# EAGLE design Sania_SCH (EAGLE 9.5.2)
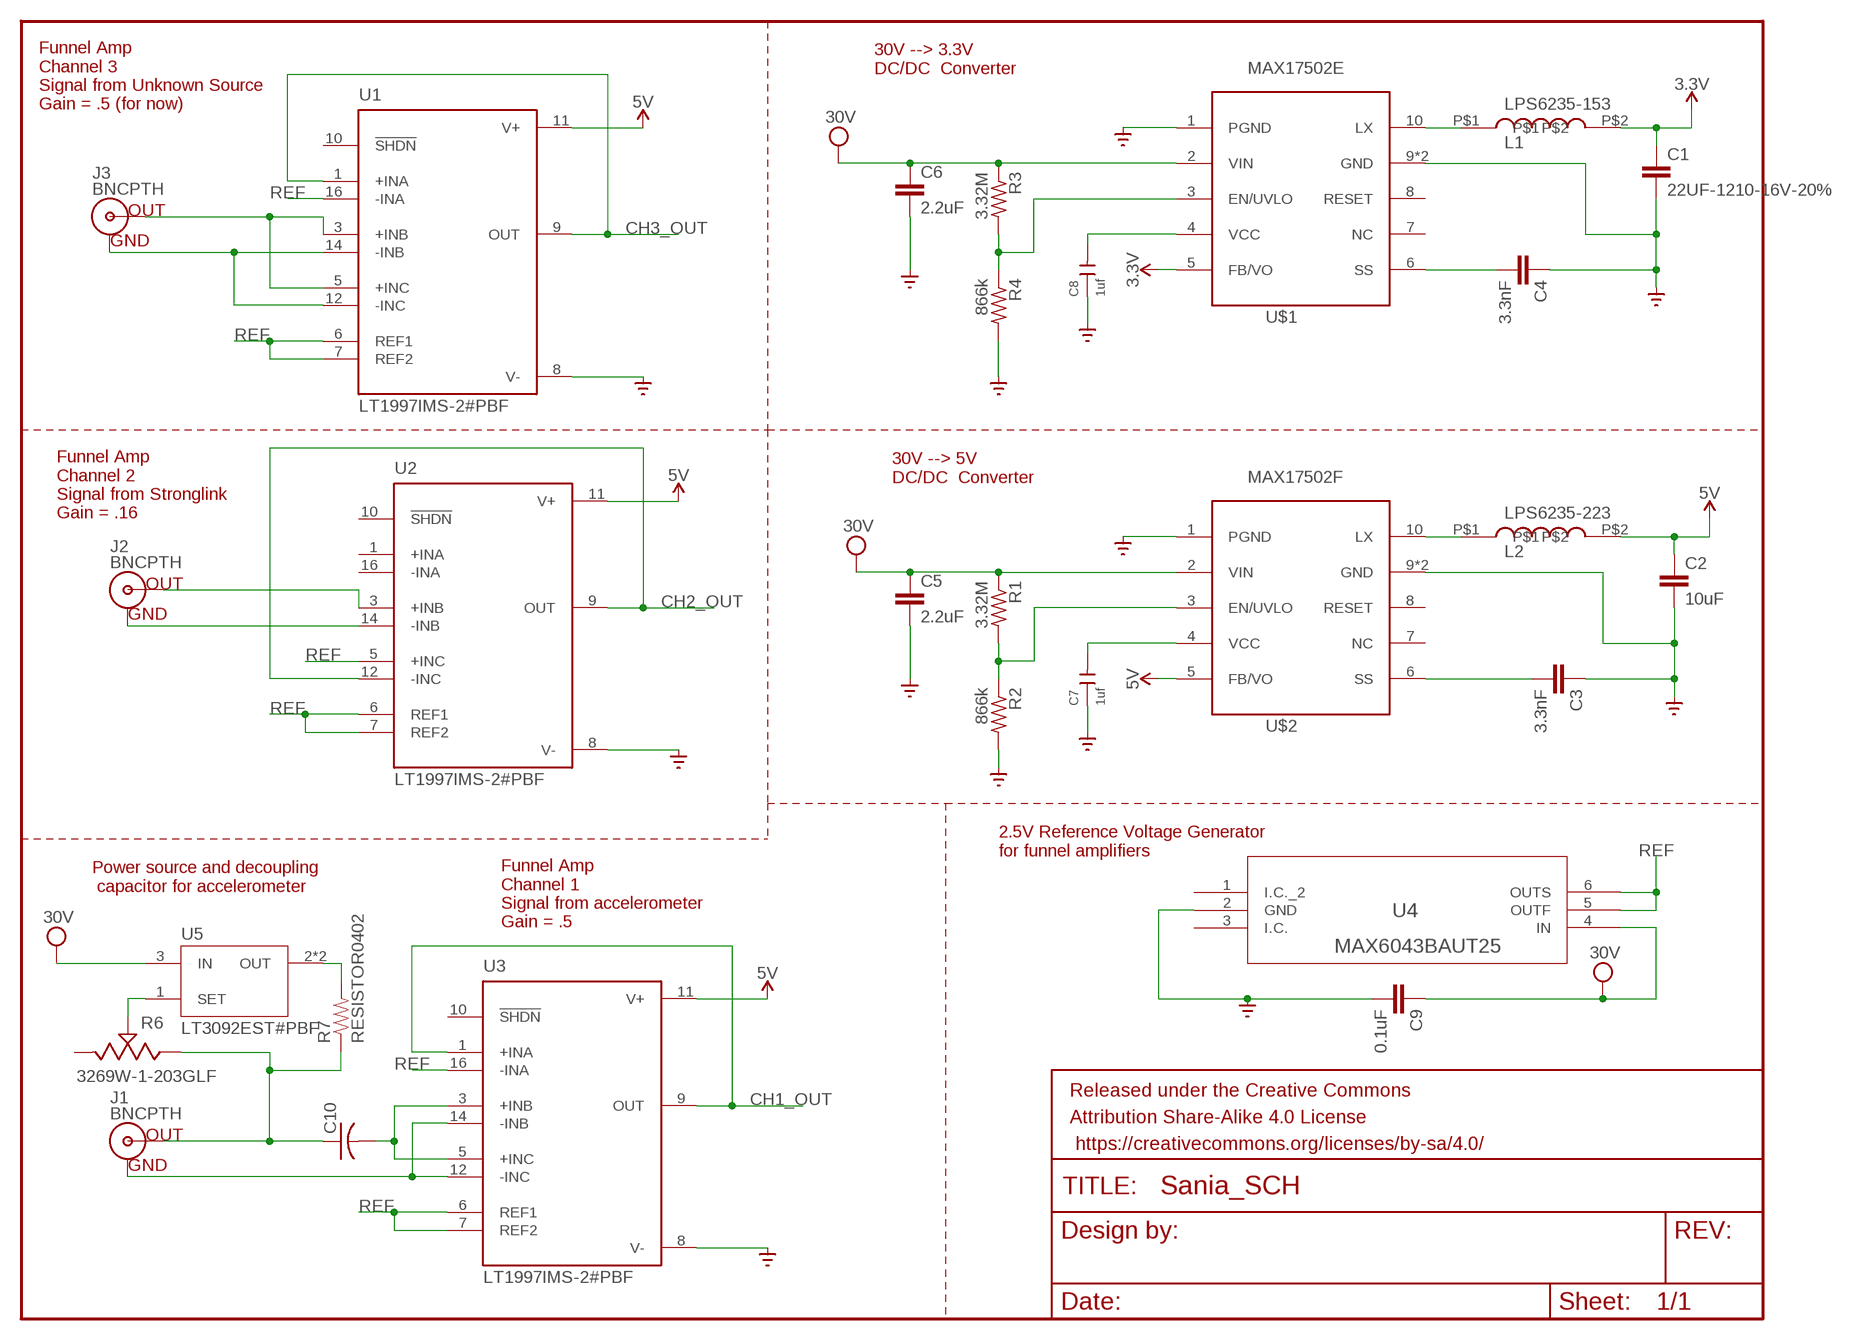
[diagram p0: schematic, sheet 1]

## Parts
C1  22UF-1210-16V-20%  [1210]
C2  10uF  10UF-1210-50V-20%  [1210]
C3  3.3nF  3.3NF-0603-100V-10%  [0603]
C4  3.3nF  3.3NF-0603-100V-10%  [0603]
C5  2.2uF  2.2UF-1206-50V-10%  [1206]
C6  2.2uF  2.2UF-1206-50V-10%  [1206]
C7  1uf  CERAMIC-1UF-25V-10%-X7R(0805)  [C0805]
C8  1uf  CERAMIC-1UF-25V-10%-X7R(0805)  [C0805]
C9  0.1uF  0.1UF-0603-25V-(+80/-20%)  [0603]
C10  C-USC0603  [C0603]
FRAME1  FRAME-LETTER  [CREATIVE_COMMONS]
J1  BNCPTH  [BNC]
J2  BNCPTH  [BNC]
J3  BNCPTH  [BNC]
L1  LPS6235-153  LPS6235  [LPS6235]
L2  LPS6235-223  LPS6235  [LPS6235]
R1  3.32M  R-US_R0805  [R0805]
R2  866k  R-US_R0805  [R0805]
R3  3.32M  R-US_R0805  [R0805]
R4  866k  R-US_R0805  [R0805]
R6  3269W-1-203GLF  [3269W-1-203GLF]
R7  RESISTOR0402  [0402-RES]
U1  LT1997IMS-2#PBF  [SOP50P490X110-12N]
U2  LT1997IMS-2#PBF  [SOP50P490X110-12N]
U3  LT1997IMS-2#PBF  [SOP50P490X110-12N]
U4  MAX6043BAUT25  [21-0058I]
U5  LT3092EST#PBF  [IC_LT3092EST#PBF]
U$1  MAX17502E  MAX17502  [SON50P200X300X80-11T90X200N]
U$2  MAX17502F  MAX17502  [SON50P200X300X80-11T90X200N]

## Nets
3.3V: C1.1 L1.P$2 U$1.5(FB/VO)
5V: C2.1 L2.P$2 U1.11(V+) U2.11(V+) U3.11(V+) U$2.5(FB/VO)
CH1_OUT: U3.1(+INA) U3.9(OUT)
CH2_OUT: U2.9(OUT) U2.12(-INC)
CH3_OUT: U1.1(+INA) U1.9(OUT)
GND: C1.2 C2.2 C3.1 C4.1 C5.2 C6.2 C7.1 C8.1 C9.2 R2.2 R4.2 U1.8(V-) U2.8(V-) U3.8(V-) U4.2(GND) U$1.1(PGND) U$1.9(GND) U$1.11(GND) U$2.1(PGND) U$2.9(GND) U$2.11(GND) ; supply symbol labelled SUPPLY_BRASTAN_GND_
N$1: L1.P$1 U$1.10(LX)
N$2: L2.P$1 U$2.10(LX)
N$3: C8.2 U$1.4(VCC)
N$4: R3.2 R4.1 U$1.3(EN/UVLO)
N$5: C4.2 U$1.6(SS)
N$6: C3.2 U$2.6(SS)
N$7: C7.2 U$2.4(VCC)
N$8: R1.2 R2.1 U$2.3(EN/UVLO)
N$9: J3.S(OUT) U1.3(+INB) U1.5(+INC)
N$10: J3.GND U1.12(-INC) U1.14(-INB)
N$11: J2.S(OUT) U2.3(+INB)
N$12: J2.GND U2.14(-INB)
N$13: C10.2 U3.3(+INB) U3.5(+INC)
N$14: J1.GND U3.12(-INC) U3.14(-INB)
N$15: R7.2 U5.2(OUT) U5.4(OUT)
N$16: R6.2 U5.1(SET)
N$17: C10.1 J1.S(OUT) R6.3 R7.1
REF: U1.6(REF1) U1.7(REF2) U1.16(-INA) U2.5(+INC) U2.6(REF1) U2.7(REF2) U3.6(REF1) U3.7(REF2) U3.16(-INA) U4.5(OUTF) U4.6(OUTS)
VCC: C5.1 C6.1 C9.1 R1.1 R3.1 U4.4(IN) U5.3(IN) U$1.2(VIN) U$2.2(VIN) ; supply symbol labelled 30V
Unconnected: R6.1 U1.10(!SHDN) U2.1(+INA) U2.10(!SHDN) U2.16(-INA) U3.10(!SHDN) U4.1(I.C._2) U4.3(I.C.) U$1.7(NC) U$1.8(RESET) U$2.7(NC) U$2.8(RESET)

## Notes on the sheet
- 30V --> 3.3V 
  DC/DC  Converter
- Funnel Amp
  Channel 3
  Signal from Unknown Source
  Gain = .5 (for now)
- 30V --> 5V 
  DC/DC  Converter
- Funnel Amp
  Channel 2
  Signal from Stronglink
  Gain = .16
- 2.5V Reference Voltage Generator
  for funnel amplifiers
- Power source and decoupling
   capacitor for accelerometer
- Funnel Amp
  Channel 1
  Signal from accelerometer
  Gain = .5

## Library data of the parts
C1 = SparkFun-Capacitors:22UF: 22µF ceramic capacitors A capacitor is a passive two-terminal electrical component used to store electrical energy temporarily in an electric field.
C2 = SparkFun-Capacitors:10UF: 10.0µF ceramic capacitors A capacitor is a passive two-terminal electrical component used to store electrical energy temporarily in an electric field.; PROD_ID: CAP-09824
C3 C4 = SparkFun-Capacitors:3.3NF: 3.3nF ceramic capacitors A capacitor is a passive two-terminal electrical component used to store electrical energy temporarily in an electric field.; PROD_ID: CAP-09633
C5 C6 = SparkFun-Capacitors:2.2UF: 2.2µF ceramic capacitors A capacitor is a passive two-terminal electrical component used to store electrical energy temporarily in an electric field.; PROD_ID: CAP-10009
C7 C8 = OPL_Capacitor:CERAMIC-1UF-25V-10%-X7R(0805): 302010179; MPN: CC0805KKX7R8BB105
C9 = SparkFun-Capacitors:0.1UF: 0.1µF ceramic capacitors A capacitor is a passive two-terminal electrical component used to store electrical energy temporarily in an electric field.; PROD_ID: CAP-00810
C10 = resistor:C-US: CAPACITOR, American symbol
FRAME1 = SparkFun-Aesthetics:FRAME-LETTER: Schematic Frame - Letter Standard 8.5x11 US Letter frame
J1-J3 = SparkFun-Connectors:BNC: BNC Right Angle Connector Mouser Part# 5227161 SparkFun Products: BNC Connector - Right Angle <https://www.sparkfun.com/products/10550>; PROD_ID: LPA-12729; SF_ID: PRT-10550
L1 L2 = LPS2635:LPS6235
R1-R4 = BeagleBone_Black_Wireless:R-US_: RESISTOR, American symbol
R6 = Potentiometer_Trimmers:3269W-1-203GLF: TRIMMER 20K OHM 0.25W GW TOP ADJ Manufacturer's datasheet <https://www.bourns.com/docs/Product-Datasheets/3269.pdf>; CREATED_BY: PCBLayout.com; DIGIKEY_PN: 3269W-1-203GLFTR-ND; MANUFACTURER: Bourns Inc.; MPN: 3269W-1-203GLF
R7 = BeagleBone_Blue_R3:RESISTOR
U1-U3 = LT1997IMS-2_PBF:LT1997IMS-2#PBF: Precision, Wide Voltage Range, D; AVAILABILITY: Unavailable; DESCRIPTION: Precision, Wide Voltage Range, D; MF: Analog Devices; MP: LT1997IMS-2#PBF; PACKAGE: MSOP-16 Analog Devices; PRICE: None
U4 = MAX6043BAUT25:MAX6043BAUT25; AVAILABILITY: Unavailable; DESCRIPTION: V-Ref Precision 2.5V 10mA 6-Pin SOT-23; MF: Maxim Integrated; MP: MAX6043BAUT25; PACKAGE: None; PRICE: None
U5 = LT3092EST_PBF:LT3092EST#PBF: Adjustable Current Source 4-Pin(3+Tab) SOT-223 Tube; AVAILABILITY: Unavailable; DESCRIPTION: Adjustable Current Source 4-Pin_3+Tab_ SOT-223 Tube; MF: Analog Devices; MP: LT3092EST#PBF; PACKAGE: SOT-223-3 Analog Devices; PRICE: None
U$1 U$2 = MAX17502:MAX17502

## Board
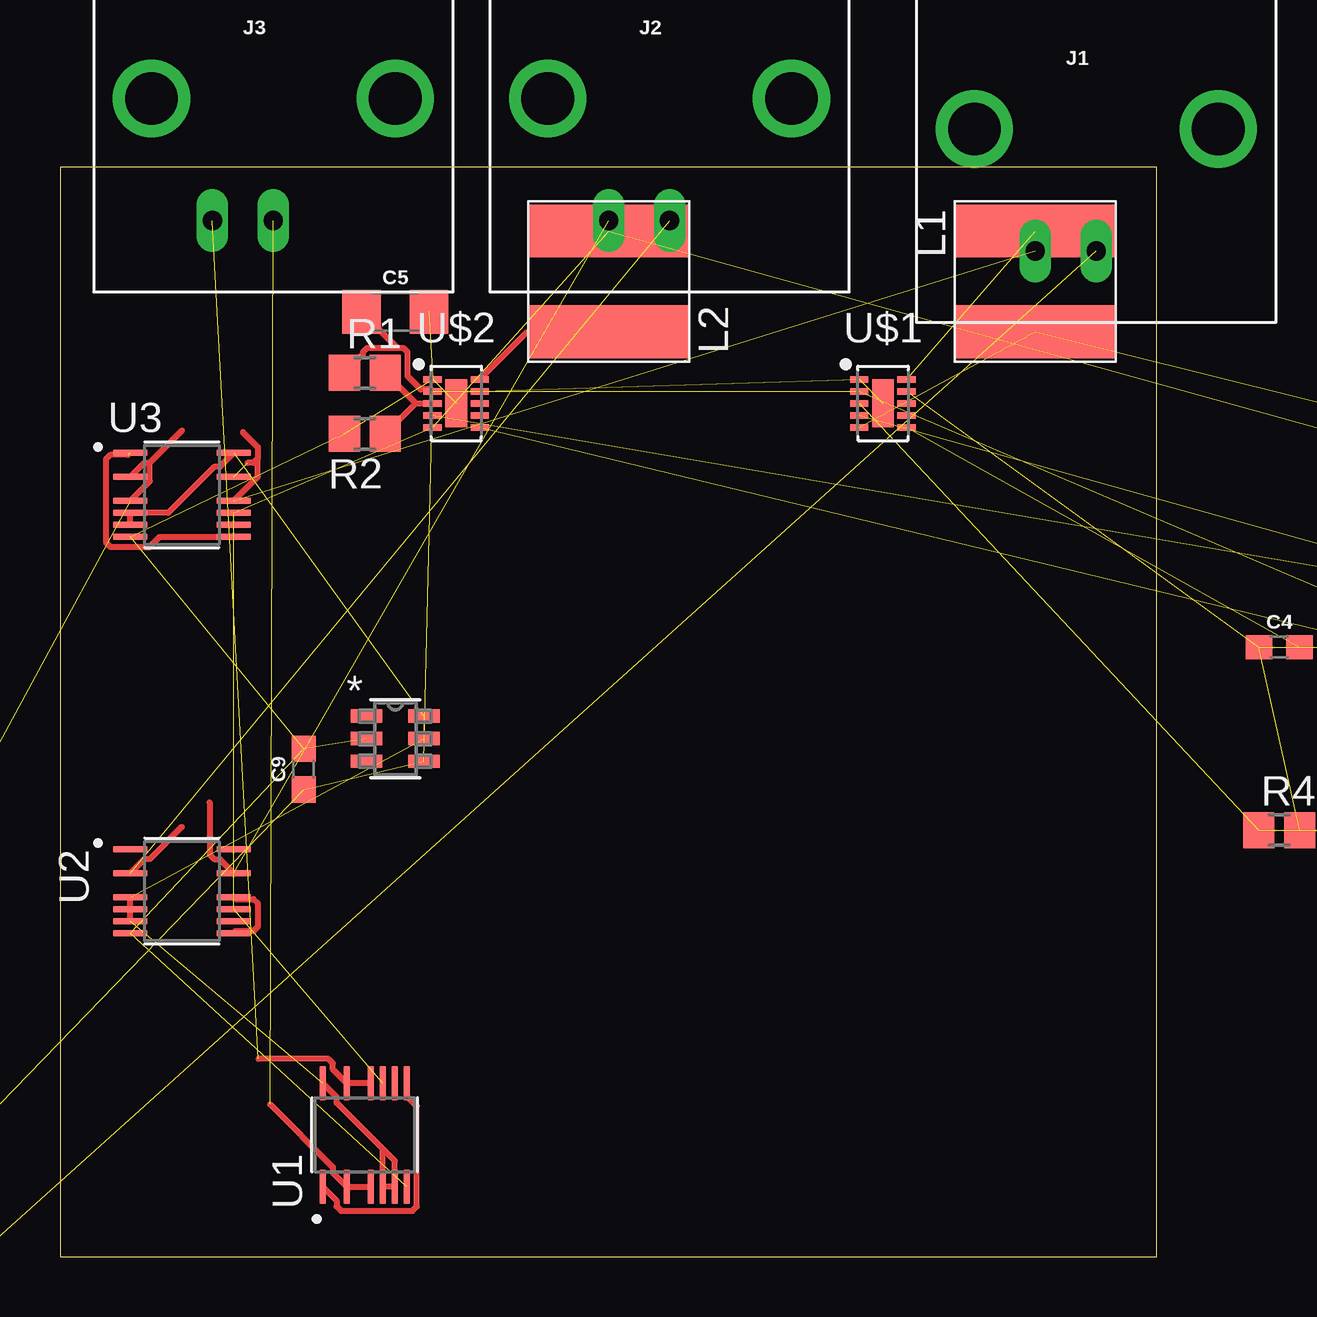
[diagram p1: board, top side]

Size 45.7 x 45.39 mm. Coordinates in mm from the lower left corner, seen from the top.
Outline: 0,0 45.7,0 45.7,45.39 0,45.39 0,0
Copper layers (1*16): Top 0.035mm / dielectric 1.5mm / Bottom 0.035mm
Design rules "default": minimum track width 6mil, minimum drill 0.35mm, track to track 6mil, track to pad 6mil, pad to pad 6mil, via to via 6mil, smd to smd 6mil, copper to edge 40mil, drill to drill 6mil, minimum pad ring 10mil, minimum via ring 8mil, stop-mask expansion 4mil, vias tented up to drill 0mil, thermal gap 10mil

### Footprints (pad centres in the part's own frame; a part is rotated, then mirrored left to right if it is on the bottom)
1210 = smd 1.27 x 2.06: 1 -1.755,0; 2 1.755,0
0603 = smd 1.1 x 1: 1 -0.85,0; 2 0.85,0
1206 = smd 1.6 x 1.8: 1 -1.4,0; 2 1.4,0
C0805 = smd 1.397 x 1.016: 1 0,0.889; 2 0,-0.889
C0603 = smd 1.1 x 1: 1 -0.85,0; 2 0.85,0
BNC = drill 2.2: 3 -5.08,5.08; 4 5.08,5.08 | drill 0.8 long: GND -2.54,0; S 0,0
LPS6235 = smd 2.2 x 6.6: P$1 -2.1,0; P$2 2.1,0
R0805 = smd 1.3 x 1.5: 1 -0.85,0; 2 0.85,0
3269W-1-203GLF = smd 1.19 x 2.79: 1 -2.54,-2.415; 2 0,2.415; 3 2.54,-2.415
0402-RES = smd 0.61 x 0.508: 1 -0.559,0; 2 0.559,0
SOP50P490X110-12N = smd 1.45 x 0.28: 1 -2.16,1.75; 3 -2.16,0.75; 5 -2.16,-0.25; 6 -2.16,-0.75; 7 -2.16,-1.25; 8 -2.16,-1.75; 9 2.16,-1.75; 10 2.16,-1.25; 11 2.16,-0.75; 12 2.16,-0.25; 14 2.16,0.75; 16 2.16,1.75
21-0058I = smd 1.321 x 0.559: 1 -1.194,0.94; 2 -1.194,0; 3 -1.194,-0.94; 4 1.194,-0.94; 5 1.194,0; 6 1.194,0.94
IC_LT3092EST#PBF = smd 1.499 x 0.991: 1 -3.15,2.286; 2 -3.15,0; 3 -3.15,-2.286 | smd 1.499 x 3.277: 4 3.15,0
SON50P200X300X80-11T90X200N = smd 0.76 x 0.27: 1 -0.985,1; 2 -0.985,0.5; 3 -0.985,0; 4 -0.985,-0.5; 5 -0.985,-1; 6 0.985,-1; 7 0.985,-0.5; 8 0.985,0; 9 0.985,0.5; 10 0.985,1 | smd 0.9 x 2: 11 0,0

### Placement (x,y rotation side)
C1  90.17,26.67 0 top  (outside the outline)
C2  82.55,26.67 0 top  (outside the outline)
C3  54.61,25.4 0 top  (outside the outline)
C4  50.8,25.4 0 top  (outside the outline)
C5  13.97,39.37 0 top
C6  59.69,25.4 0 top  (outside the outline)
C7  77.47,25.4 0 top  (outside the outline)
C8  71.12,25.4 0 top  (outside the outline)
C9  10.16,20.32 90 top
C10  -26.67,-21.59 0 top  (outside the outline)
FRAME1  15.24,-8.89 0 top  (outside the outline)
J1  43.18,41.91 0 top
J2  25.4,43.18 0 top
J3  8.89,43.18 0 top
L1  40.64,40.64 270 top
L2  22.86,40.64 90 top
R1  12.7,36.83 0 top
R2  12.7,34.29 180 top
R3  63.5,17.78 0 top  (outside the outline)
R4  50.8,17.78 0 top  (outside the outline)
R6  -22.86,-7.62 0 top  (outside the outline)
R7  -26.67,-17.78 0 top  (outside the outline)
U1  12.7,5.08 90 top
U2  5.08,15.24 0 top
U3  5.08,31.75 0 top
U4  13.97,21.59 0 top
U5  -11.43,-3.81 0 top  (outside the outline)
U$1  34.29,35.56 0 top
U$2  16.51,35.56 0 top

### Tracks (layer width: path | path; a pad name or v marks a point on that pad's centre or on a via)
3.3V  (2 unrouted)
5V  (5 unrouted)
CH1_OUT  (1 unrouted)
  Top 0.254: 2.84,33.42 2.1,33.42 1.92,33.23 1.92,29.77 2.1,29.58 3.74,29.58 4.16,30 U3.9
CH2_OUT
  Top 0.254: U2.12 7.32,14.91 8.06,14.91 8.24,14.72 8.24,13.76 8.06,13.57 7.32,13.57 U2.9
CH3_OUT
  Top 0.254: U1.1 11.53,2.34 11.53,2.1 11.71,1.92 14.69,1.92 14.87,2.1 14.87,6.28 14.45,6.7 U1.9
GND  (18 unrouted)
N$1  (1 unrouted)
N$2
  Top 0.254: U$2.10 19.48,38.54 L2.P$1
N$3  (1 unrouted)
N$4  (2 unrouted)
N$5  (1 unrouted)
N$6  (1 unrouted)
N$7  (1 unrouted)
N$8
  Top 0.254: R1.2 14.82,35.56 | 14.82,35.56 U$2.3 | 14.82,35.56 R2.1
N$9  (1 unrouted)
  Top 0.254: 8.76,6.35 11.37,3.74 11.37,3.5 U1.3 U1.5
N$10  (1 unrouted)
  Top 0.254: U1.12 U1.14 11.37,7.82 11.37,8.06 11.19,8.24 8.27,8.24
N$11  (1 unrouted)
  Top 0.254: U2.3 3.5,16.57 3.74,16.57 5.08,17.91
N$12  (1 unrouted)
  Top 0.254: U2.14 6.66,16.57 6.42,16.57 6.24,16.75 6.24,18.94
N$13  (1 unrouted)
  Top 0.254: U3.3 3.5,33.08 3.74,33.08 3.75,33.09 | 3.75,33.09 5.08,34.42 | U3.5 3.75,32.33 3.75,33.09
N$14  (2 unrouted)
  Top 0.254: 8.24,33.27 8.24,33.73 7.62,34.36 | 8.24,33.27 8.06,33.08 7.82,33.08 | U3.12 8.24,32.5 8.24,33.27
N$15  (2 unrouted)
N$16  (1 unrouted)
N$17  (3 unrouted)
REF  (4 unrouted)
  Top 0.254: U3.7 U3.6 4.5,31 6.42,32.92 6.66,32.92 U3.16 | U2.7 U2.6 U2.5 | U1.16 11.53,6.66 11.53,6.42 13.95,4 U1.7 U1.6 13.45,4.5
VCC  (6 unrouted)
  Top 0.254: U$2.2 15.44,36.15 15.03,36.15 14.48,36.7 14.48,37.7 14.32,37.86 14.08,37.86 | 14.08,37.86 C5.1 | R1.1 12.62,37.6 12.62,37.7 12.78,37.86 14.08,37.86